# Altium schematic sheet Top Level.SchDoc
size A; SheetNumber: 1; SheetTotal: 6
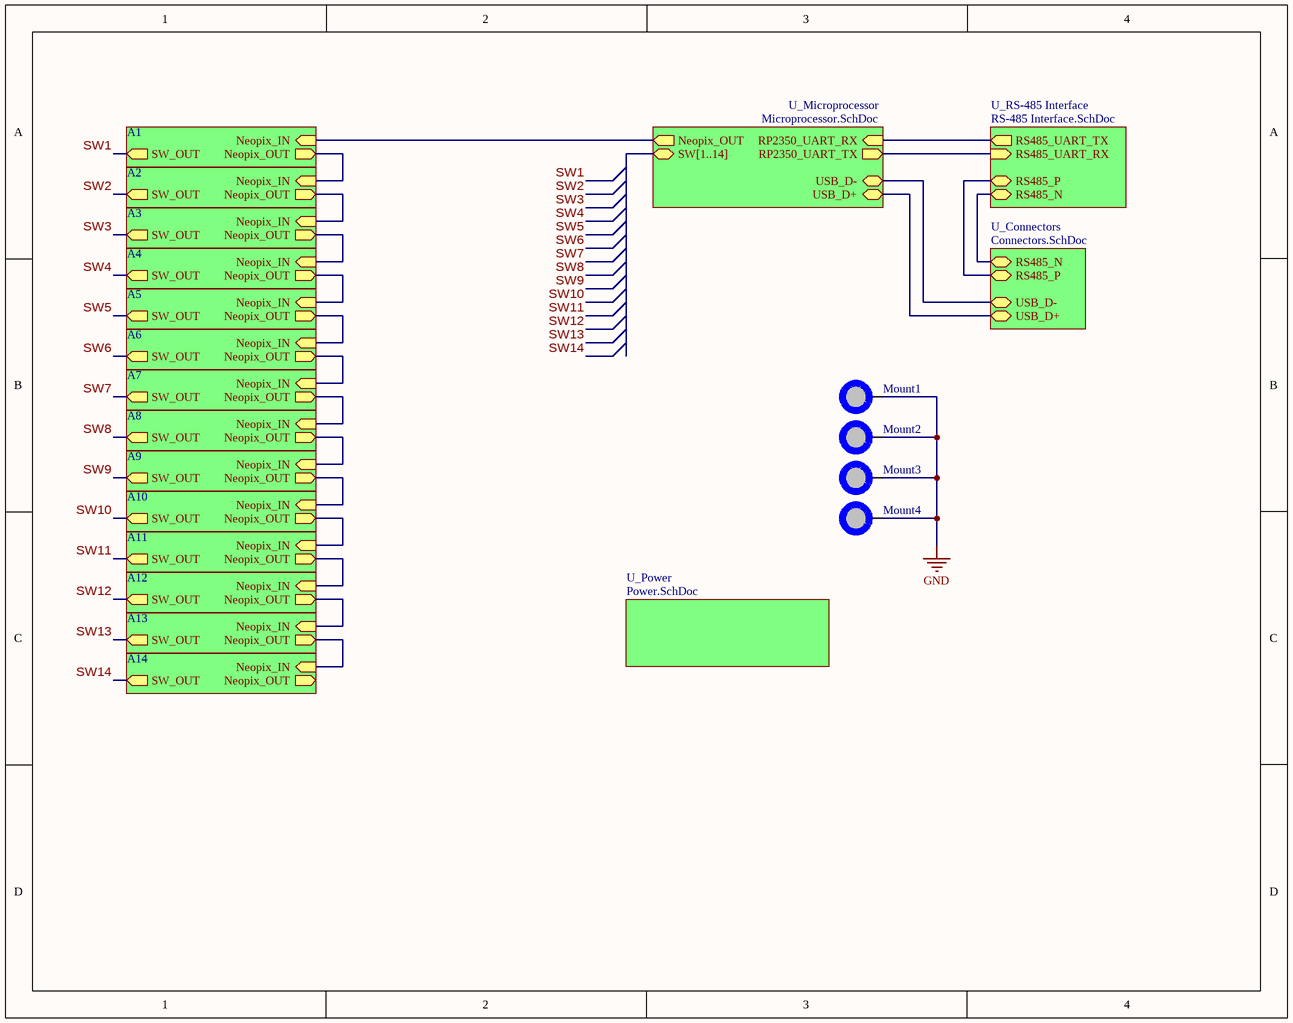
[diagram p0: Top Level.SchDoc]

## Parts
Mount1  M3 Mount Hole  [[Mount] M3 Mount Hole]  (value not drawn)  (no BOM)
Mount2  M3 Mount Hole  [[Mount] M3 Mount Hole]  (value not drawn)  (no BOM)
Mount3  M3 Mount Hole  [[Mount] M3 Mount Hole]  (value not drawn)  (no BOM)
Mount4  M3 Mount Hole  [[Mount] M3 Mount Hole]  (value not drawn)  (no BOM)

## Sub-sheets
A1 = 2mL Socket.SchDoc: SW_OUT (out), Neopix_IN (in), Neopix_OUT (out)
A2 = 2mL Socket.SchDoc: SW_OUT (out), Neopix_IN (in), Neopix_OUT (out)
A3 = 2mL Socket.SchDoc: SW_OUT (out), Neopix_IN (in), Neopix_OUT (out)
A4 = 2mL Socket.SchDoc: SW_OUT (out), Neopix_IN (in), Neopix_OUT (out)
A5 = 2mL Socket.SchDoc: SW_OUT (out), Neopix_IN (in), Neopix_OUT (out)
A6 = 2mL Socket.SchDoc: SW_OUT (out), Neopix_IN (in), Neopix_OUT (out)
A7 = 2mL Socket.SchDoc: SW_OUT (out), Neopix_IN (in), Neopix_OUT (out)
A8 = 2mL Socket.SchDoc: SW_OUT (out), Neopix_IN (in), Neopix_OUT (out)
A9 = 2mL Socket.SchDoc: SW_OUT (out), Neopix_IN (in), Neopix_OUT (out)
A10 = 2mL Socket.SchDoc: SW_OUT (out), Neopix_IN (in), Neopix_OUT (out)
A11 = 2mL Socket.SchDoc: SW_OUT (out), Neopix_IN (in), Neopix_OUT (out)
A12 = 2mL Socket.SchDoc: SW_OUT (out), Neopix_IN (in), Neopix_OUT (out)
A13 = 2mL Socket.SchDoc: SW_OUT (out), Neopix_IN (in), Neopix_OUT (out)
A14 = 2mL Socket.SchDoc: SW_OUT (out), Neopix_IN (in), Neopix_OUT (out)
U_Connectors = Connectors.SchDoc: RS485_P (bidir), RS485_N (bidir), USB_D+ (bidir), USB_D- (bidir)
U_Microprocessor = Microprocessor.SchDoc: SW[1..14] (bidir), RP2350_UART_RX (in), RP2350_UART_TX (out), Neopix_OUT (out), USB_D+ (bidir), USB_D- (bidir)
U_Power = Power.SchDoc: no entries
U_RS-485 Interface = RS-485 Interface.SchDoc: RS485_UART_TX (out), RS485_UART_RX (in), RS485_P (bidir), RS485_N (bidir)

## Nets
GND: Mount1.1 Mount2.1 Mount3.1 Mount4.1
SW1: sheet A1/SW_OUT
SW2: sheet A2/SW_OUT
SW3: sheet A3/SW_OUT
SW4: sheet A4/SW_OUT
SW5: sheet A5/SW_OUT
SW6: sheet A6/SW_OUT
SW7: sheet A7/SW_OUT
SW8: sheet A8/SW_OUT
SW9: sheet A9/SW_OUT
SW10: sheet A10/SW_OUT
SW11: sheet A11/SW_OUT
SW12: sheet A12/SW_OUT
SW13: sheet A13/SW_OUT
SW14: sheet A14/SW_OUT
(unnamed): sheet U_Microprocessor/RP2350_UART_RX, sheet U_RS-485 Interface/RS485_UART_TX
(unnamed): sheet U_Microprocessor/RP2350_UART_TX, sheet U_RS-485 Interface/RS485_UART_RX
(unnamed): sheet U_Microprocessor/Neopix_OUT, sheet A1/Neopix_IN
(unnamed): sheet U_Microprocessor/USB_D+, sheet U_Connectors/USB_D+
(unnamed): sheet U_Microprocessor/USB_D-, sheet U_Connectors/USB_D-
(unnamed): sheet U_Connectors/RS485_P, sheet U_RS-485 Interface/RS485_P
(unnamed): sheet U_Connectors/RS485_N, sheet U_RS-485 Interface/RS485_N
(unnamed): sheet A1/Neopix_OUT, sheet A2/Neopix_IN
(unnamed): sheet A2/Neopix_OUT, sheet A3/Neopix_IN
(unnamed): sheet A3/Neopix_OUT, sheet A4/Neopix_IN
(unnamed): sheet A4/Neopix_OUT, sheet A5/Neopix_IN
(unnamed): sheet A5/Neopix_OUT, sheet A6/Neopix_IN
(unnamed): sheet A6/Neopix_OUT, sheet A7/Neopix_IN
(unnamed): sheet A7/Neopix_OUT, sheet A8/Neopix_IN
(unnamed): sheet A8/Neopix_OUT, sheet A9/Neopix_IN
(unnamed): sheet A9/Neopix_OUT, sheet A10/Neopix_IN
(unnamed): sheet A10/Neopix_OUT, sheet A11/Neopix_IN
(unnamed): sheet A11/Neopix_OUT, sheet A12/Neopix_IN
(unnamed): sheet A12/Neopix_OUT, sheet A13/Neopix_IN
(unnamed): sheet A13/Neopix_OUT, sheet A14/Neopix_IN

## Library data of the parts
Mount1-Mount4 = [Mount] M3 Mount Hole: Place at least 4.5mm from board edge. Plated.